# Altium schematic sheet upravljanje razvodnikom.SchDoc
size A
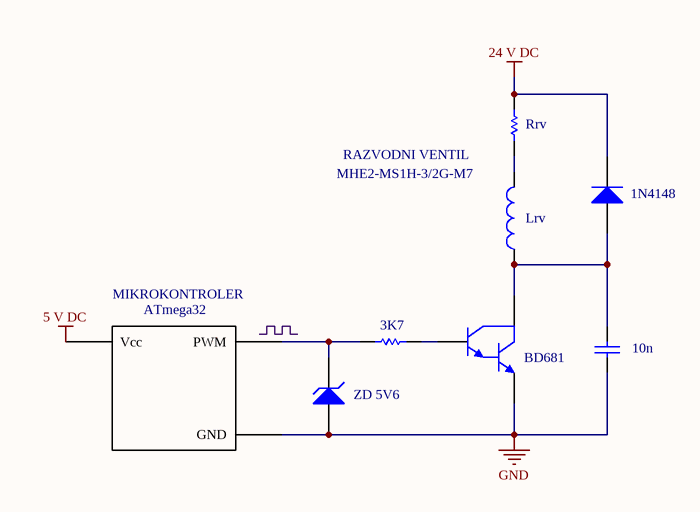
[diagram p0: upravljanje razvodnikom.SchDoc]

## Parts
1N4148  MHE2-MS1H-3/2G-M7  [SMC]
3K7  RAZVODNI VENTIL  [AXIAL-0.5]
10n  Cap  [RAD-0.3]  (value not drawn)
Lrv  Inductor  [0402-A]  (value not drawn)
MIKROKONTROLER  ATmega32
Q?  BD681  [TO-92]
Rrv  Rrv  [AXIAL-0.3]  (value not drawn)
ZD_5V6  D Zener  [DIODE-0.7]  (value not drawn)

## Nets
5 V DC: MIKROKONTROLER.?2(Vcc)
24 V DC: 1N4148.2(K) Rrv.2
GND: 10n.2 MIKROKONTROLER.?3(GND) Q?.3(E) ZD_5V6.1(A)
Net1N4148_1: 1N4148.1(A) 10n.1 Lrv.1 Q?.1(C)
Net3K7_1: 3K7.1 MIKROKONTROLER.?1(PWM) ZD_5V6.2(K)
Net3K7_2: 3K7.2 Q?.2(B)
NetLrv_2: Lrv.2 Rrv.1

## Library data of the parts
1N4148 = Diode: Default Diode; Published: 8-Jun-2000; LatestRevisionDate: 17-Jul-2002; LatestRevisionNote: Re-released for DXP Platform.; PackageVersion: Sep-1996; PackageReference: SMC; Publisher: Altium Limited; PackageDescription: DO-214-AB/SMC; 2 C-Bend Leads; Body 7.9 x 5.9 mm, inc. leads (LxW); Code_JEDEC: DO-214-AB
3K7 = Res Semi: Semiconductor Resistor; Published: 8-Jun-2000; LatestRevisionDate: 17-Jul-2002; LatestRevisionNote: Re-released for DXP Platform.; PackageReference: AXIAL-0.5; Publisher: Altium Limited; PackageDescription: Axial Device, Thru-Hole; 2 Leads; 0.5 in Pin Spacing
10n = Cap: Capacitor; Published: 8-Jun-2000; LatestRevisionDate: 17-Jul-2002; LatestRevisionNote: Re-released for DXP Platform.; PackageReference: RAD-0.3; Publisher: Altium Limited; PackageDescription: Radial Cap, Thru-Hole; 2 Leads; 0.3 in Pin Spacing
Lrv = Inductor: Code_IEC: 1005; Published: 8-Jun-2000; LatestRevisionDate: 29-May-2009; LatestRevisionNote: IPC-7351 Footprint Added.; PackageReference: 0402-A; Publisher: Altium Limited; PackageDescription: Chip Inductor; Code_JEITA: 0402
MIKROKONTROLER = Component_1
Q? = NPN1: NPN Darlington Bipolar Transistor; Published: 8-Jun-2000; LatestRevisionDate: 17-Jul-2002; LatestRevisionNote: Re-released for DXP Platform.; DatasheetVersion: 1989; PackageVersion: 1989; PackageReference: TO-92; Publisher: Altium Limited; PackageDescription: TO, Flat Index; 3 In-Line, Axial Leads; Body Dia. 4.6mm; Leads 0.41 x 0.39 mm (max); Code_JEDEC: TO-92
Rrv = Res1: Resistor; Published: 8-Jun-2000; LatestRevisionDate: 17-Jul-2002; LatestRevisionNote: Re-released for DXP Platform.; PackageReference: AXIAL-0.3; Publisher: Altium Limited; PackageDescription: Axial Device, Thru-Hole; 2 Leads; 0.3 in Pin Spacing
ZD_5V6 = D Zener: Zener Diode; Published: 8-Jun-2000; LatestRevisionDate: 17-Jul-2002; LatestRevisionNote: Re-released for DXP Platform.; PackageReference: DIODE-0.7; Publisher: Altium Limited; PackageDescription: Diode, Thru-Hole; 2 Leads; 0.7 in Pin Spacing